# EAGLE design SparkFun_Pocket_Amp (EAGLE 7.7.0)
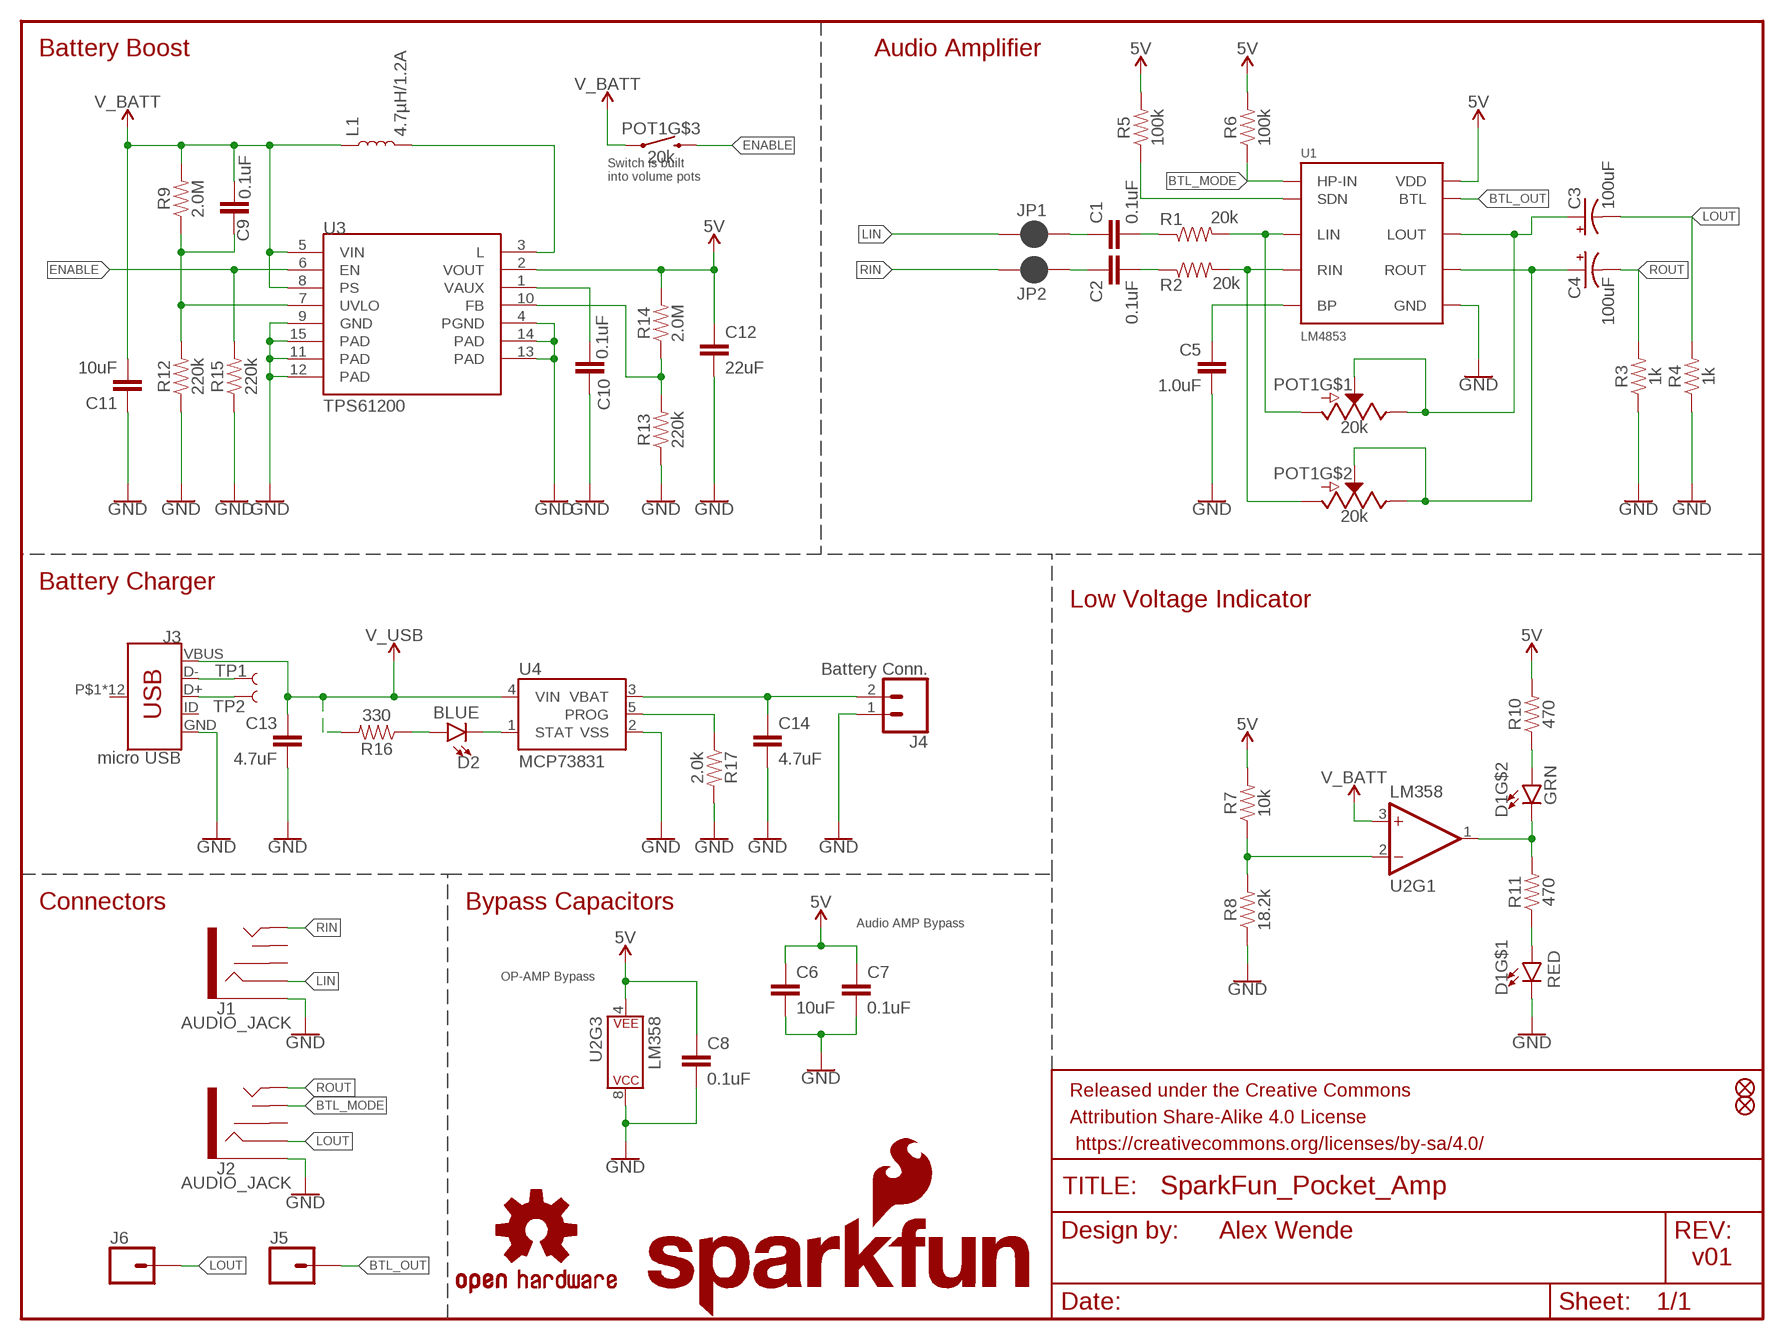
[diagram p0: schematic, sheet 1]

## Parts
C1  0.1uF  0.1UF-KIT-EZ-50V-20%  [CAP-PTH-SMALL-KIT]
C2  0.1uF  0.1UF-KIT-EZ-50V-20%  [CAP-PTH-SMALL-KIT]
C3  100uF  100UF-POLAR-RADIAL-2.5MM-25V-20%  [CPOL-RADIAL-2.5MM-6.5MM]
C4  100uF  100UF-POLAR-RADIAL-2.5MM-25V-20%  [CPOL-RADIAL-2.5MM-6.5MM]
C5  1.0uF  1.0UF-0603-16V-10%  [0603]
C6  10uF  10UF-0805-10V-10%  [0805]
C7  0.1uF  0.1UF-0603-25V-(+80/-20%)  [0603]
C8  0.1uF  0.1UF-0603-25V-(+80/-20%)  [0603]
C9  0.1uF  0.1UF-0603-25V-(+80/-20%)  [0603]
C10  0.1uF  0.1UF-0603-25V-(+80/-20%)  [0603]
C11  10uF  10UF-0805-10V-10%  [0805]
C12  22uF  22UF-1210-16V-20%  [1210]
C13  4.7uF  4.7UF0603  [0603]
C14  4.7uF  4.7UF0603  [0603]
D1  LED Inicator  LED_RG6300T15  [LED_3MM_RG_SMD]
D2  BLUE  LED-BLUE0603  [LED-0603]
FD1  FIDUCIALUFIDUCIAL  [FIDUCIAL-MICRO]
FD2  FIDUCIALUFIDUCIAL  [FIDUCIAL-MICRO]
FRAME1  FRAME-LETTER  [CREATIVE_COMMONS]
J1  AUDIO_JACK  AUDIO_JACK_3.5MM_SMD  [AUDIO-JACK-3.5MM-SMD]
J2  AUDIO_JACK  AUDIO_JACK_3.5MM_SMD  [AUDIO-JACK-3.5MM-SMD]
J3  micro USB  USB_MICRO-B_HALF_PTH  [USB-MICROB-PTH]
J4  Battery Conn.  CONN_02-JST-2MM-SMT  [JST-2-SMD]
J5  CONN_01PTH_NO_SILK_KIT  [1X01NS_KIT]
J6  CONN_01PTH_NO_SILK_KIT  [1X01NS_KIT]
JP1  JUMPER-SMT_2_NC_PASTE_NO-SILK  [SMT-JUMPER_2_NC_PASTE_NO-SILK]
JP2  JUMPER-SMT_2_NC_PASTE_NO-SILK  [SMT-JUMPER_2_NC_PASTE_NO-SILK]
L1  4.7µH/1.2A  INDUCTOR-CDRH-4.7UH  [INDUCTOR_4.7UH]
LOGO1  SFE_LOGO_NAME_FLAME.1_INCH  [SFE_LOGO_NAME_FLAME_.1]
LOGO2  OSHW-LOGOM  [OSHW-LOGO-M]
POT1  20k  POTENTIOMETER_DUAL_W/SWITCH  [POT-DUAL-SWITCH-PTH]
R1  20k  RESISTORAXIAL-0.3-KIT  [AXIAL-0.3-KIT]
R2  20k  RESISTORAXIAL-0.3-KIT  [AXIAL-0.3-KIT]
R3  1k  RESISTORAXIAL-0.3-KIT  [AXIAL-0.3-KIT]
R4  1k  RESISTORAXIAL-0.3-KIT  [AXIAL-0.3-KIT]
R5  100k  RESISTORAXIAL-0.3-KIT  [AXIAL-0.3-KIT]
R6  100k  RESISTORAXIAL-0.3-KIT  [AXIAL-0.3-KIT]
R7  10k  RESISTORAXIAL-0.3-KIT  [AXIAL-0.3-KIT]
R8  18.2k  RESISTORAXIAL-0.3-KIT  [AXIAL-0.3-KIT]
R9  2.0M  2MOHMS-0603-1/10W-1%  [0603]
R10  470  RESISTORAXIAL-0.3-KIT  [AXIAL-0.3-KIT]
R11  470  RESISTORAXIAL-0.3-KIT  [AXIAL-0.3-KIT]
R12  220k  220KOHM-0603-1/10W-1%  [0603]
R13  220k  220KOHM-0603-1/10W-1%  [0603]
R14  2.0M  2MOHMS-0603-1/10W-1%  [0603]
R15  220k  220KOHM-0603-1/10W-1%  [0603]
R16  330  330OHM-0603-1/10W-1%  [0603]
R17  2.0k  2.0KOHM-0603-1/10W-5%  [0603]
TP1  TEST-POINT3  [PAD.03X.03]
TP2  TEST-POINT3  [PAD.03X.03]
U1  LM4853  [TFSOP-10]
U2  LM358  LM358KIT  [DIP08-KIT]
U3  TPS61200  [QFN-10_PAD]
U4  MCP73831  [SOT23-5]

## Nets
5V: C6.1 C7.1 C8.1 C12.1 R5.P$2 R6.P$2 R7.P$2 R10.P$2 R14.2 U1.VDD U2.4(P$V-) U3.2(VOUT)
BTL_MODE: J2.TSH R6.P$1 U1.HP-IN
BTL_OUT: J5.1 U1.BTL
ENABLE: POT1.SW2 R15.2 U3.6(EN)
GND: C5.2 C6.2 C7.2 C8.2 C10.1 C11.1 C12.2 C13.2 C14.2 D1.1(C) J1.SLEEVE J2.SLEEVE J3.GND J4.1 R3.P$1 R4.P$1 R8.P$1 R12.1 R13.1 R15.1 R17.2 U1.GND U2.8(P$V+) U3.4(PGND) U3.9(GND) U3.11(PAD) U3.12(PAD) U3.13(PAD) U3.14(PAD) U3.15(PAD) U4.2(VSS)
IN_L: C1.1 JP1.2
IN_R: C2.1 JP2.2
LIN: J1.RING JP1.1
LOUT: C3.2(-) J2.RING J6.1 R4.P$2
N$1: POT1.A1(A) R1.P$2 U1.LIN
N$2: POT1.B1(A) R2.P$2 U1.RIN
N$3: C1.2 R1.P$1
N$4: C2.2 R2.P$1
N$5: C5.1 U1.BP
N$6: R7.P$1 R8.P$2 U2.2(-IN)
N$7: C9.1 R9.1 R12.2 U3.7(UVLO)
N$8: C3.1(+) POT1.A2(E) POT1.A3(S) U1.LOUT
N$9: R5.P$1 U1.SDN
N$10: J3.D- TP1.P$1
N$11: D1.3(A) R10.P$1
N$12: C4.1(+) POT1.B2(E) POT1.B3(S) U1.ROUT
N$13: D1.2(A) R11.P$1
N$14: D2.C U4.1(STAT)
N$15: D2.A R16.1
N$16: L1.P$2 U3.3(L)
N$17: D1.4(C) R11.P$2 U2.1(OUT)
N$18: J3.D+ TP2.P$1
N$19: C10.2 U3.1(VAUX)
N$20: R13.2 R14.1 U3.10(FB)
N$22: C14.1 J4.2 U4.3(VBAT)
N$23: R17.1 U4.5(PROG)
RIN: J1.TIP JP2.1
ROUT: C4.2(-) J2.TIP R3.P$2
V_BATT: C9.2 C11.2 L1.P$1 POT1.SW1 R9.2 U2.3(+IN) U3.5(VIN) U3.8(PS)
V_USB: C13.1 J3.VBUS R16.2 U4.4(VIN)
Unconnected: J1.RSH J1.TSH J2.RSH J3.ID J3.P$1(SHIELD) J3.P$2(SHIELD) J3.P$3(SHIELD) J3.P$4(SHIELD) J3.P$6(SHIELD) J3.P$8(SHIELD) J3.P$10(SHIELD) J3.P$12(SHIELD) J3.SHEILD2(SHIELD) J3.SHIELD J3.SHIELD3(SHIELD) J3.SHIELD4(SHIELD) U2.5(+IN) U2.6(-IN) U2.7(OUT)

## Notes on the sheet
- Battery Boost | Audio Amplifier
- Switch is built 
  into volume pots
- Battery Charger
- Low Voltage Indicator
- GRN
- Connectors | Bypass Capacitors
- Audio AMP Bypass
- OP-AMP Bypass
- RED
- Alex Wende
- v01

## Library data of the parts
C1 C2 = SparkFun-Capacitors:0.1UF: 0.1µF ceramic capacitors A capacitor is a passive two-terminal electrical component used to store electrical energy temporarily in an electric field.; PROD_ID: CAP-08370
C3 C4 = SparkFun-Capacitors:100UF-POLAR: 100µF polarized capacitors A capacitor is a passive two-terminal electrical component used to store electrical energy temporarily in an electric field.; PROD_ID: CAP-08439
C5 = SparkFun-Capacitors:1.0UF: 1µF ceramic capacitors A capacitor is a passive two-terminal electrical component used to store electrical energy temporarily in an electric field.; PROD_ID: CAP-00868
C6 C11 = SparkFun-Capacitors:10UF: 10.0µF ceramic capacitors A capacitor is a passive two-terminal electrical component used to store electrical energy temporarily in an electric field.; PROD_ID: CAP-11330
C7-C10 = SparkFun-Capacitors:0.1UF: 0.1µF ceramic capacitors A capacitor is a passive two-terminal electrical component used to store electrical energy temporarily in an electric field.; PROD_ID: CAP-00810
C12 = SparkFun-Capacitors:22UF: 22µF ceramic capacitors A capacitor is a passive two-terminal electrical component used to store electrical energy temporarily in an electric field.; PROD_ID: CAP-10381
C13 C14 = SparkFun-Capacitors:4.7UF: 4.7µF ceramic capacitors A capacitor is a passive two-terminal electrical component used to store electrical energy temporarily in an electric field.; PROD_ID: CAP-08280
D1 = SparkFun-LED:LED_RG
D2 = SparkFun-LED:LED-BLUE: Blue SMD LED Used in manufacturing of various products at SparkFun Packages: 0603 - SMD 0603 package [Product Link] <http://www.digikey.com/product-detail/en/SMLE12BC7TT86/511-1589-2-ND/1641808> 1206 - SMD1206 package [Product Link] <http://www.digikey.com/product-detail/en/lite-on-inc/LTST-C150TBKT/160-1643-1-ND/573584> SparkFun Products: ESP8266 Thing-Dev Board <https://www.sparkfun.com/products/13711> RedBoard <https://www.sparkfun.com/products/12757>; PROD_ID: DIO-08575
FD1 FD2 = SparkFun-Aesthetics:FIDUCIAL: Fiducial Alignment Points Point-of-reference for pick-and-place machines and other optical instruments.
FRAME1 = SparkFun-Aesthetics:FRAME-LETTER: Schematic Frame - Letter Standard 8.5x11 US Letter frame
J1 J2 = SparkFun-Connectors:AUDIO_JACK_3.5MM: Audio Jack 3.5mm variants of PTH and SMT stereo audio jack with bypass switches. SparkFun Products: SparkFun SparkPunk Sound Kit <[https://www.sparkfun.com/products/11177]> - PTH MP3 Trigger <https://www.sparkfun.com/products/13720> -3.5mm SMD SparkFun PicoBoard <https://www.sparkfun.com/products/11888>- 2.5mm SMD; PROD_ID: CONN-10353
J3 = SparkFun-Connectors:USB_MICRO-B: USB Type Micro-B Connector Male/female and PTH/SMT variants SparkFun Products: SparkFun microB USB Breakout <https://www.sparkfun.com/products/12035> SparkFun USB microB Plug Breakout <https://www.sparkfun.com/products/10031> SparkFun ESP8266 Thing <https://www.sparkfun.com/products/13231>; PROD_ID: CONN-13711; VALUE: AMP FCI 10103594-0001LF
J4 = SparkFun-Connectors:CONN_02: Multi connection point. Often used as Generic Header-pin footprint for 0.1 inch spaced/style header connections On any of the 0.1 inch spaced packages, you can populate with these: Break Away Headers - Straight (PRT-00116) Break Away Male Headers - Right Angle (PRT-00553) Female Headers (PRT-00115) Break Away Headers - Machine Pin (PRT-00117) Break Away Female Headers - Swiss Machine Pin (PRT-00743) For SCREWTERMINALS and SPRING TERMINALS visit here: Screw Terimnals on SparkFun.com (5mm/3.5mm/2.54mm spacing) This device is also useful as a general connection point to wire up your design to another part of your project. Our various solder wires solder well into these plated through hole pads. Hook-Up Wire - Assortment (Stranded, 22 AWG) (PRT-11375) Hook-Up Wire - Assortment (Solid Core, 22 AWG) (PRT-11367) View the entire wire category on our website here Special notes: Molex polarized connector foot print use with: PRT-08233 with associated crimp pins and housings. 2.54_SCREWTERM for use with PRT-10571. 3.5mm Screw Terminal footprints for PRT-08084 5mm Screw Terminal footprints for use with PRT-08432; PROD_ID: CONN-11443
J5 J6 = SparkFun-Connectors:CONN_01: Single connection point. Often used as Generic Header-pin footprint for 0.1 inch spaced/style header connections On any of the 0.1 inch spaced packages, you can populate with these: Break Away Headers - Straight (PRT-00116) Break Away Male Headers - Right Angle (PRT-00553) Female Headers (PRT-00115) Break Away Headers - Machine Pin (PRT-00117) Break Away Female Headers - Swiss Machine Pin (PRT-00743) This device is also useful as a general connection point to wire up your design to another part of your project. Our various solder wires solder well into these plated through hole pads. Hook-Up Wire - Assortment (Stranded, 22 AWG) (PRT-11375) Hook-Up Wire - Assortment (Solid Core, 22 AWG) (PRT-11367) View the entire wire category on our website here Special notes: SMTSO-256-ET is a "flush mount" nut for a 4-40 screw. We mostly use this on specialty testbeds; it is a nice way to connect hardware to your PCB at an adjustable hieght. Also note, the SNAP packages are for using a snappable style connector. We sell a baggie of snaps and they are also used on two LilyPad designs: Snap Assortment - 30 pack (male and female) (DEV-11347) LilyPad Arduino SimpleSnap (DEV-10941) LilyPad SimpleSnap Protoboard (DEV-10940)
JP1 JP2 = SparkFun-Jumpers:JUMPER-SMT_2_NC_PASTE: Normally closed solder jumper This jumper has an aperture in the stencil to allow solder paste to bridge the split in the wire so it's normally closed (NC). Wick off the solder to open the connection. Reapply solder to reclose the connection.
L1 = SparkFun-Coils:INDUCTOR: Inductors Resist changes in electrical current. Basically a coil of wire. SparkFun Products: SparkFun Load Cell Amplifier - HX711 IOIO-OTG - V2.2; PROD_ID: NDUC-10146; VALUE: 4.7µH/±30%/1.2A
LOGO1 = SparkFun-Aesthetics:SFE_LOGO_NAME_FLAME: SparkFun Font Logo w/ Flame This is the SparkFun full logo. The logo on the schematic will always be the same size; the package variant is the height of the flame part of the logo. Default layer for the logo on the board is tSilk.
LOGO2 = SparkFun-Aesthetics:OSHW-LOGO: Open-Source Hardware (OSHW) Logo This logo indicates the piece of hardware it is found on incorporates a OSHW license and/or adheres to the definition of open source hardware found here: http://freedomdefined.org/OSHW
POT1 = SparkFun-Resistors:POTENTIOMETER_DUAL_W/SWITCH
R1-R8 R10 R11 = SparkFun-Resistors:RESISTOR: Generic Resistor Package
R9 R14 = SparkFun-Resistors:2MOHMS: 2MΩ resistor A resistor is a passive two-terminal electrical component that implements electrical resistance as a circuit element. Resistors act to reduce current flow, and, at the same time, act to lower voltage levels within circuits. - Wikipedia; PROD_ID: RES-10054
R12 R13 R15 = SparkFun-Resistors:220KOHM: 220kΩ resistor A resistor is a passive two-terminal electrical component that implements electrical resistance as a circuit element. Resistors act to reduce current flow, and, at the same time, act to lower voltage levels within circuits. - Wikipedia; PROD_ID: RES-08969
R16 = SparkFun-Resistors:330OHM: 330Ω resistor A resistor is a passive two-terminal electrical component that implements electrical resistance as a circuit element. Resistors act to reduce current flow, and, at the same time, act to lower voltage levels within circuits. - Wikipedia; PROD_ID: RES-00818
R17 = SparkFun-Resistors:2.0KOHM: 2kΩ resistor A resistor is a passive two-terminal electrical component that implements electrical resistance as a circuit element. Resistors act to reduce current flow, and, at the same time, act to lower voltage levels within circuits. - Wikipedia; PROD_ID: RES-08296
TP1 TP2 = SparkFun-Connectors:TEST-POINT: SparkFun Test Points Bare copper test points for troubleshooting or In-Circuit-Testing. These are used by our Production team for verifying production board runs using pogo-pins on test beds. SparkFun Products: SparkFun LSM9DS1 Breakout <https://www.sparkfun.com/products/13284> SparkFun PSOC <https://www.sparkfun.com/products/13714> SparkFun Load Cell Amplifier <https://www.sparkfun.com/products/13879>
U1 = SparkFun-IC-Amplifiers:LM4853
U2 = SparkFun-IC-Amplifiers:LM358: LM358 Jellybean op-amp Datasheet SparkFun Products Op-Amp (Thru-Hole) - LM358 (COM-09456); PROD_ID: IC-09172
U3 = SparkFun-IC-Power:TPS61200: DC to DC Booster IC-10035; PROD_ID: IC-10035
U4 = SparkFun-IC-Power:MCP73831: MCP73831T Li-Ion, Li-Pol Controller Miniature single cell, fully integrated Li-Ion, Li-polymer charge management controller Datasheet <http://ww1.microchip.com/downloads/en/DeviceDoc/20001984g.pdf> SparkFun Products: SparkFun ESP32 Thing <https://www.sparkfun.com/products/13907> SparkFun 9DoF Razor IMU M0 <https://www.sparkfun.com/products/14001>; PROD_ID: IC-09995

## Board
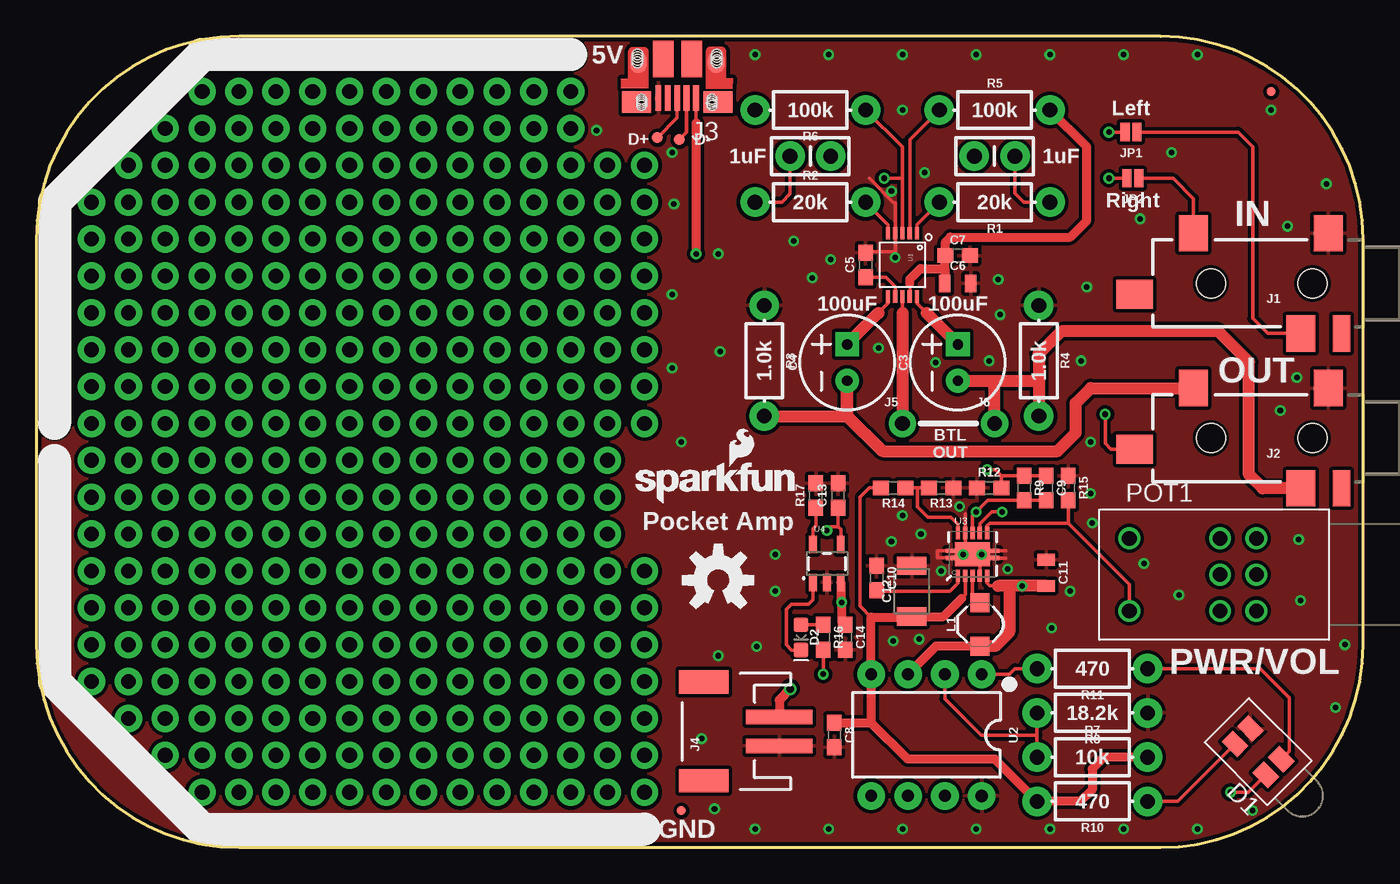
[diagram p1: board, top side]
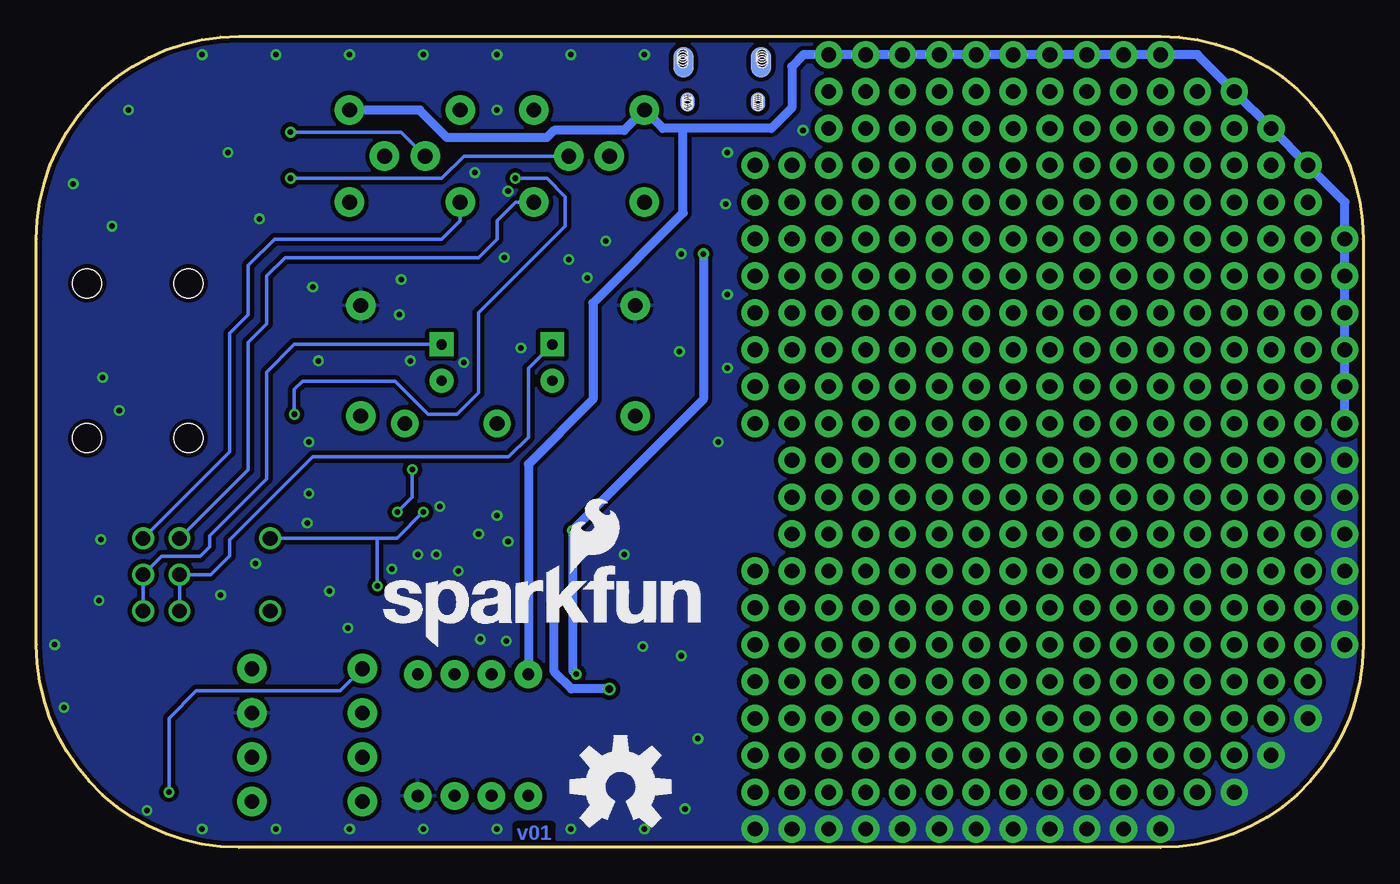
[diagram p2: board, bottom side, seen from below]

Size 91.44 x 55.88 mm. Coordinates in mm from the lower left corner, seen from the top.
Outline: 91.44,13.97 91.44,41.91 arc90 77.47,55.88 13.97,55.88 arc90 0,41.91 0,13.97 arc90 13.97,0 77.47,0 arc90 91.44,13.97
Copper layers (1*16): Top 0.035mm / dielectric 1.5mm / Bottom 0.035mm
Design rules "SparkFun-2-layer-TIGHT": minimum track width 7mil, minimum drill 15mil, track to track 7mil, track to pad 7mil, pad to pad 7mil, via to via 7mil, smd to smd 7mil, copper to edge 7mil, drill to drill 7mil, minimum pad ring 7mil, minimum via ring 7mil, stop-mask expansion 4mil, vias tented up to drill 25mil, thermal gap 10mil

### Footprints (pad centres in the part's own frame; a part is rotated, then mirrored left to right if it is on the bottom)
CAP-PTH-SMALL-KIT = drill 1.016 pad 2.032: 1 -1.397,0; 2 1.397,0
CPOL-RADIAL-2.5MM-6.5MM = drill 0.7 pad 1.651 square: 1 1.25,0 | drill 0.7 pad 1.651: 2 -1.25,0
0603 = smd 1.1 x 1: 1 -0.85,0; 2 0.85,0
0805 = smd 0.8 x 1.2: 1 -0.9,0; 2 0.9,0
1210 = smd 1.27 x 2.06: 1 -1.755,0; 2 1.755,0
LED_3MM_RG_SMD = smd 1.5 x 1.1: 1 1.5,-0.75; 2 -1.5,-0.75; 3 1.5,0.75; 4 -1.5,0.75
LED-0603 = smd 1 x 1: A -0.877,0; C 0.877,0
FIDUCIAL-MICRO = smd 0.635 x 0.635: 1 0,0
AUDIO-JACK-3.5MM-SMD = smd 2 x 2.5: RING 4.3,3.45; SLEEVE 2.4,-3.45; TIP 11.7,-3.45 | smd 1.2 x 2.5: RSH 1.5,3.45 | smd 2.5 x 2: TSH 15.75,0.75 | hole 2: 3.5,0; 10.5,0
USB-MICROB-PTH = smd 0.4 x 1.75: D+ 0.031,1.331; D- -0.619,1.331; GND 1.331,1.331; ID 0.681,1.331; VBUS -1.269,1.331 | smd 1.4 x 2.1 bottom: P$1 2.701,-1.142; P$3 -2.659,-1.144 | smd 1 x 1.3: P$2 2.487,1.594; P$6 -2.368,1.604 | smd 1 x 1.3 bottom: P$4 -2.368,1.604; P$10 2.481,1.598 | smd 1.1 x 1.5: P$8 2.701,-1.142; P$12 -2.659,-1.144 | smd 2 x 1.46: SHEILD2 2.831,1.606; SHIELD -2.794,1.606 | smd 1.425 x 2.5: SHIELD3 -0.979,-1.349; SHIELD4 0.996,-1.352 | hole 0.7: -2.693,-1.134; -2.693,-1.3; -2.694,-1.499; -2.694,-1.664; 2.768,-1.134; 2.767,-1.303; 2.766,-1.496; 2.766,-1.664 | hole 0.66: -2.359,1.821; -2.349,1.691; -2.359,1.541; -2.354,1.432; 2.481,1.821; 2.491,1.691; 2.481,1.541; 2.486,1.432
JST-2-SMD = smd 1 x 4.6: 1 -1,-3.7; 2 1,-3.7 | smd 1.6 x 3.4: NC1 -3.4,1.5; NC2 3.4,1.5
1X01NS_KIT = drill 1.016 pad 1.88: 1 0,0
SMT-JUMPER_2_NC_PASTE_NO-SILK = smd 0.635 x 1.27: 1 -0.406,0; 2 0.406,0
INDUCTOR_4.7UH = smd 1.3 x 1.3: P$1 -1.5,0; P$2 1.5,0
POT-DUAL-SWITCH-PTH = drill 1: A1 0,2.5; A2 0,0; A3 0,-2.5; B1 -2.5,2.5; B2 -2.5,0; B3 -2.5,-2.5; SW1 -8.75,2.5; SW2 -8.75,-2.5
AXIAL-0.3-KIT = drill 1.016 pad 2.032: P$1 -3.81,0; P$2 3.81,0
PAD.03X.03 = smd 0.762 x 0.762: P$1 0,0
TFSOP-10 = smd 0.85 x 0.29: BP 2.175,-0.5; BTL 2.175,0; GND -2.175,-0.5; HP-IN -2.175,0; LIN -2.175,1; LOUT 2.175,1; RIN -2.175,-1; ROUT 2.175,-1; SDN -2.175,0.5; VDD 2.175,0.5
DIP08-KIT = drill 0.813 pad 1.905: 1 -3.81,-4.191; 2 -1.27,-4.191; 3 1.27,-4.191; 4 3.81,-4.191; 5 3.81,4.191; 6 1.27,4.191; 7 -1.27,4.191 | drill 0.864 pad 1.905: 8 -3.81,4.191
QFN-10_PAD = smd 0.297 x 0.85: 1 -1,-1.475; 2 -0.5,-1.475; 3 0,-1.475; 4 0.5,-1.475; 5 1,-1.475; 6 1,1.475; 7 0.5,1.475; 8 0,1.475; 9 -0.5,1.475; 10 -1,1.475 | smd 0.7 x 0.28: 11 -1.5,0.25; 12 -1.5,-0.25; 13 1.5,0.25; 14 1.5,-0.25 | smd 2.4 x 1.65: 15 0,0
SOT23-5 = smd 0.55 x 1.2: 1 -0.95,-1.3; 2 0,-1.3; 3 0.95,-1.3; 4 0.95,1.3; 5 -0.95,1.3

### Placement (x,y rotation side)
C1  66.04,47.62 0 top
C2  53.34,47.62 180 top
C3  63.5,33.4 90 top
C4  55.88,33.4 90 top
C5  57.15,40.13 90 top
C6  63.5,38.86 0 top
C7  63.5,40.77 0 top
C8  54.99,7.75 270 top
C9  69.6,24.77 270 top
C10  57.91,18.57 270 top
C11  69.6,18.92 270 top
C12  60.33,17.65 90 top
C13  55.24,24.26 90 top
C14  55.75,14.48 270 top
D1  84.2,6.6 135 top
D2  52.7,14.48 270 top
FD1  44.45,2.54 0 top
FD2  85.09,52.07 0 top
FRAME1  12.7,-21.59 0 top  (outside the outline)
J1  91.44,38.86 180 top
J2  91.44,28.19 180 top
J3  44.2,52.96 180 top
J4  47.5,8 90 top
J5  59.69,29.21 0 top
J6  66.04,29.21 0 top
JP1  75.44,49.28 180 top
JP2  75.56,46.1 180 top
L1  65.02,15.37 90 top
LOGO1  40.89,23.62 0 top
LOGO2  46.99,18.41 0 top
POT1  84.07,18.8 0 top
R1  66.04,44.45 180 top
R2  53.34,44.45 0 top
R3  50.16,33.53 270 top
R4  69.09,33.53 270 top
R5  66.04,50.8 0 top
R6  53.34,50.8 180 top
R7  72.77,6.22 0 top
R8  72.77,9.27 180 top
R9  68.07,24.77 270 top
R10  72.77,3.17 180 top
R11  72.77,12.32 180 top
R12  65.66,24.77 0 top
R13  62.36,24.77 180 top
R14  59.05,24.77 180 top
R15  71.12,24.77 270 top
R16  54.23,14.48 270 top
R17  53.72,24.26 90 top
TP1  44.32,48.77 0 top
TP2  42.8,48.9 0 top
U1  59.69,40.13 270 top
U2  61.34,7.75 180 top
U3  64.52,20.19 0 top
U4  54.48,19.56 0 top
U$1  [SFE_LOGO_NAME_FLAME_.2]  68.2,13.72 0 bottom
U$2  [OSHW-LOGO-L]  51.18,4.19 0 bottom

### Tracks (layer width: path | path; a pad name or v marks a point on that pad's centre or on a via)
5V  (via drill 1.02 pad 1.88)
  Top 0.254: U1.VDD 60.19,38.85 | U3.2 64.02,17.41 63.75,17.14 | R14.2 57.4,24.77 56.77,24.13 56.77,16.64 57.53,15.88
  Top 0.61: 60.19,38.85 60.19,39.13 60.94,39.88 62.6,39.88 | 62.6,39.88 C6.1 | 62.6,39.88 62.6,40.72 C7.1 62.65,41.7 62.99,42.04 71.25,42.04 72.39,43.18 72.39,48.26 R5.P$2 | 57.53,8.6 U2.4 57.53,15.88 60.2,15.88 C12.1 62.51,15.9 63.75,17.14 | 57.53,8.6 60.03,6.1 66.04,6.1 R10.P$2 71.96,3.17 72.77,3.99 72.77,5.41 73.58,6.22 R7.P$2 | C8.1 57.53,8.6
  Bottom 0.61: R5.P$2 65.02,50.8 63.12,48.9 56.26,48.9 55.75,49.4 50.93,49.4 R6.P$2 48.26,49.53 46.86,49.53 | U2.4 57.53,26.42 53.09,30.86 53.09,37.49 46.86,43.72 46.86,49.53 | 46.86,49.53 40.79,49.53 39.37,50.95 39.37,53.8 38.56,54.61 v36.83,54.61 v34.29,54.61 v31.75,54.61 v29.21,54.61 v26.67,54.61 v24.13,54.61 v21.59,54.61 v19.05,54.61 v16.51,54.61 v13.97,54.61 11.43,54.61 v8.89,52.07 v6.35,49.53 v3.81,46.99 1.27,44.45 v1.27,41.91 v1.27,39.37 v1.27,36.83 v1.27,34.29 v1.27,31.75 v1.27,29.21
BTL_MODE  (via drill 0.38)
  Top 0.254: R6.P$1 59.69,48.26 59.69,46.1 | 59.69,46.1 U1.HP-IN | J2.TSH 74.05,27.44 73.66,27.83 v73.66,29.84 | v58.42,46.1 59.69,46.1
  Bottom 0.254: v73.66,29.84 73.66,31.56 73.09,32.13 66.72,32.13 64.44,29.84 62.44,29.84 60.96,31.33 60.96,36.83 54.99,42.8 54.99,44.84 56.25,46.1 v58.42,46.1
BTL_OUT
  Top 0.254: U1.BTL 59.69,36.83
  Top 0.813: 59.69,36.83 J5.1
ENABLE
  Top 0.254: R15.2 71.12,22.35 | 71.12,22.35 65.71,22.35 65.52,22.16 U3.6 | 71.12,22.35 75.32,18.15 POT1.SW2
GND  (via drill 0.38, 1.02 pad 1.88)
  Top 0.254: 57.15,41.02 59.19,41.02 U1.GND 59.19,44.42 59.08,44.42 57.4,46.1 | U3.15 64.02,20.19 U3.9 64.02,23 | U3.4 65.02,20.19 U3.15 | U3.14 66.8,19.94 | 64.52,20.45 66.8,20.45 | U3.15 64.52,20.45 | 64.52,20.45 62.1,20.45 62.1,19.94 U3.12
  other vias: 88.9,45.72 86.23,42.8 86.87,32.38 85.72,30.1 59.05,14.22 60.83,14.35 65.15,20.19 63.88,20.19 58.93,21.08 60.96,21.59 59.69,22.86 62.36,19.05 66.93,19.18 71.25,17.65 63.63,23.5 41.91,1.27 39.37,1.27 36.83,1.27 34.29,1.27 31.75,1.27 29.21,1.27 26.67,1.27 24.13,1.27 21.59,1.27 19.05,1.27 16.51,1.27 13.97,1.27 8.89,3.81 6.35,6.35 3.81,8.89 1.27,13.97 1.27,16.51 1.27,19.05 1.27,21.59 1.27,24.13 1.27,26.67 49.53,54.61 54.61,54.61 59.69,54.61 64.77,54.61 69.85,54.61 74.93,54.61 80.01,54.61 85.09,50.8 90.17,13.97 89.53,9.65 83.82,2.54 80.01,1.27 74.93,1.27 69.85,1.27 64.77,1.27 59.69,1.27 54.61,1.27 49.53,1.27 69.98,15.11 50.93,20.19 50.93,17.65 49.66,13.84 46.99,13.21 45.85,7.49 46.74,2.67 54.74,40.51 52.2,41.78 53.47,39.24 58.04,34.42 65.66,33.53 61.98,33.4 66.29,39.12 66.42,36.7 72.39,38.61 72.01,33.53 72.64,27.94 72.64,24.38 72.77,22.35 76.33,19.56 78.74,17.4 87,21.21 87.12,17.02 46.99,40.89 47.12,34.16 44.45,27.94 38.61,49.4 43.81,47.88 43.94,44.32 43.81,38.1 43.81,33.02 59.18,40.64 58.93,45.21 59.69,50.8 61.21,46.48 76.07,43.31 78.23,47.88
  pour Top (isolate 0.254, rank 2): 0,41.91 0,13.97 arc90 13.97,0 77.47,0 arc90 91.44,13.97 91.44,41.91 arc90 77.47,55.88 13.97,55.88 arc90
  pour Bottom (isolate 0.305, rank 2): 0,41.91 0,13.97 arc90 13.97,0 77.47,0 arc90 91.44,13.97 91.44,41.91 arc90 77.47,55.88 13.97,55.88 arc90
IN_L  (via drill 0.38)
  Top 0.254: JP1.2 v73.91,49.28
  Bottom 0.254: C1.1 66.29,49.28 v73.91,49.28
IN_R  (via drill 0.38)
  Top 0.254: JP2.2 v73.91,46.1
  Bottom 0.254: v73.91,46.1 63.5,46.1 61.98,47.62 C2.1
LIN
  Top 0.254: J1.RING 84.85,35.41 83.82,36.45 83.82,48.28 82.83,49.28 JP1.1
LOUT
  Top 0.813: 69.09,32.15 69.09,34.02 70.63,35.56 81.45,35.56 83.57,33.45 83.57,25.69 84.51,24.74 J2.RING | 69.09,32.15 R4.P$2 | C3.2 66.04,32.15 | 66.04,32.15 69.09,32.15 | J6.1 66.04,32.15
N$1
  Top 0.254: R1.P$2 60.69,42.91 U1.LIN
  Bottom 0.254: R1.P$2 62.23,43.18 63.5,41.91 75.03,41.91 76.83,40.1 76.83,36.7 78.11,35.43 78.11,27.27 POT1.A1
N$2
  Top 0.254: R2.P$2 58.69,42.91 U1.RIN
  Bottom 0.254: R2.P$2 58.42,44.45 59.69,43.18 59.69,41.91 60.96,40.64 74.3,40.64 75.56,39.37 75.56,36.07 76.83,34.8 76.83,26.04 POT1.B1
N$3
  Top 0.254: C1.2 67.44,45.09 68.07,44.45 R1.P$1
N$4
  Top 0.254: C2.2 51.94,45.02 51.38,44.45 R2.P$1
N$5
  Top 0.254: C5.1 58.55,39.28 59.19,38.64 U1.BP
N$6
  Top 0.254: U2.2 62.61,10.26 65.12,7.75 68.96,7.75 | 68.96,7.75 R8.P$2 | R7.P$1 68.96,7.75
N$7  (via drill 0.38)
  Top 0.254: 68.07,25.65 R9.1 | R9.1 C9.1 | U3.7 65.02,22.3 65.83,23.11 v66.55,23.11 | 66.55,24.77 R12.2 66.51,25.61 | R9.1 66.51,25.61 | v65.53,26.04 66.09,26.04 66.51,25.61
  Bottom 0.254: v66.55,23.11 65.53,24.13 v65.53,26.04
N$8
  Top 0.254: U1.LOUT 60.69,37.48 61.34,36.83
  Top 0.813: 61.34,36.83 63.5,34.67 C3.1
  Bottom 0.254: POT1.A3 POT1.A2 82.8,20.07 80.14,20.07 79.5,20.7 79.5,21.46 75.56,25.4 75.56,32.75 73.66,34.65 C3.1
N$9
  Top 0.254: R5.P$1 60.19,48.76 U1.SDN
N$10
  Top 0.254: J3.D- 44.81,49.26 TP1.P$1
N$11
  Top 0.254: D1.3 78.65,3.17 R10.P$1
N$12
  Top 0.254: U1.ROUT 58.69,37.48 58.04,36.83
  Top 0.813: 58.04,36.83 55.88,34.67 C4.1
  Bottom 0.254: POT1.B3 POT1.B2 79.41,18.8 78.11,20.1 78.11,21.21 72.39,26.92 58.88,26.92 57.53,28.27 57.53,33.02 55.88,34.67 C4.1
N$13
  Top 0.254: R11.P$1 84.35,12.32 86.36,10.31 86.36,6.64 D1.2
N$14
  Top 0.254: U4.1 53.53,17.08 53.21,16.76 52.05,16.76 51.69,16.41 51.69,13.95 52.04,13.6 D2.C
N$15
  Top 0.254: D2.A 54.23,15.36 R16.1
N$16
  Top 0.254: U3.3 64.52,16.99 65.02,16.99 L1.P$2
N$17  (via drill 0.38)
  Top 0.254: U2.1 67.06,11.94 67.44,12.32 R11.P$2 | v82.3,3.81 83.53,3.81 D1.4
  Bottom 0.254: v82.3,3.81 82.3,8.91 80.41,10.79 70.48,10.79 R11.P$2
N$18
  Top 0.254: J3.D+ 44.16,50.26 TP2.P$1
N$19
  Top 0.254: U3.1 63.52,18.2 62.97,17.65 57.91,17.65 C10.2
N$20
  Top 0.254: U3.10 63.52,22.26 63.05,22.73 61.45,22.73 60.71,23.47 60.71,24.77 | 60.71,24.77 R13.2 | R14.1 60.71,24.77
N$22  (via drill 0.38, 0.51)
  Top 0.61: v51.94,10.92 51.2,10.18 J4.2 | U4.3 55.43,16.96 v55.5,16.89 55.5,15.58 C14.1
  Bottom 0.61: v51.94,10.92 54.55,10.92 55.75,12.12 55.75,16.64 v55.5,16.89
N$23
  Top 0.254: U4.5 53.53,21.97 53.72,22.16 R17.1
N$34  (via drill 1.02 pad 1.88)
  other vias: 3.81,41.91
N$35  (via drill 1.02 pad 1.88)
  other vias: 3.81,44.45
N$39  (via drill 1.02 pad 1.88)
  other vias: 11.43,52.07
N$41  (via drill 1.02 pad 1.88)
  other vias: 13.97,52.07
N$51  (via drill 1.02 pad 1.88)
  other vias: 36.83,52.07
N$52  (via drill 1.02 pad 1.88)
  other vias: 36.83,49.53
N$53  (via drill 1.02 pad 1.88)
  other vias: 36.83,46.99
N$54  (via drill 1.02 pad 1.88)
  other vias: 39.37,46.99
N$55  (via drill 1.02 pad 1.88)
  other vias: 41.91,46.99
N$56  (via drill 1.02 pad 1.88)
  other vias: 36.83,44.45
N$57  (via drill 1.02 pad 1.88)
  other vias: 36.83,41.91
N$58  (via drill 1.02 pad 1.88)
  other vias: 36.83,39.37
N$59  (via drill 1.02 pad 1.88)
  other vias: 36.83,36.83
N$60  (via drill 1.02 pad 1.88)
  other vias: 36.83,34.29
N$61  (via drill 1.02 pad 1.88)
  other vias: 36.83,31.75
N$62  (via drill 1.02 pad 1.88)
  other vias: 36.83,29.21
N$63  (via drill 1.02 pad 1.88)
  other vias: 36.83,26.67
N$64  (via drill 1.02 pad 1.88)
  other vias: 36.83,24.13
N$65  (via drill 1.02 pad 1.88)
  other vias: 36.83,21.59
N$66  (via drill 1.02 pad 1.88)
  other vias: 36.83,19.05
N$67  (via drill 1.02 pad 1.88)
  other vias: 36.83,16.51
N$68  (via drill 1.02 pad 1.88)
  other vias: 36.83,13.97
N$69  (via drill 1.02 pad 1.88)
  other vias: 36.83,11.43
N$70  (via drill 1.02 pad 1.88)
  other vias: 36.83,8.89
N$71  (via drill 1.02 pad 1.88)
  other vias: 36.83,6.35
N$72  (via drill 1.02 pad 1.88)
  other vias: 36.83,3.81
N$83  (via drill 1.02 pad 1.88)
  other vias: 11.43,3.81
N$88  (via drill 1.02 pad 1.88)
  other vias: 13.97,3.81
N$89  (via drill 1.02 pad 1.88)
  other vias: 16.51,3.81
N$90  (via drill 1.02 pad 1.88)
  other vias: 19.05,3.81
N$91  (via drill 1.02 pad 1.88)
  other vias: 21.59,3.81
N$92  (via drill 1.02 pad 1.88)
  other vias: 24.13,3.81
N$93  (via drill 1.02 pad 1.88)
  other vias: 26.67,3.81
N$94  (via drill 1.02 pad 1.88)
  other vias: 29.21,3.81
N$95  (via drill 1.02 pad 1.88)
  other vias: 31.75,3.81
N$96  (via drill 1.02 pad 1.88)
  other vias: 34.29,3.81
N$97  (via drill 1.02 pad 1.88)
  other vias: 34.29,6.35
N$98  (via drill 1.02 pad 1.88)
  other vias: 31.75,6.35
N$99  (via drill 1.02 pad 1.88)
  other vias: 29.21,6.35
N$100  (via drill 1.02 pad 1.88)
  other vias: 26.67,6.35
N$101  (via drill 1.02 pad 1.88)
  other vias: 24.13,6.35
N$102  (via drill 1.02 pad 1.88)
  other vias: 21.59,6.35
N$103  (via drill 1.02 pad 1.88)
  other vias: 19.05,6.35
N$104  (via drill 1.02 pad 1.88)
  other vias: 16.51,6.35
N$105  (via drill 1.02 pad 1.88)
  other vias: 13.97,6.35
N$106  (via drill 1.02 pad 1.88)
  other vias: 11.43,6.35
N$107  (via drill 1.02 pad 1.88)
  other vias: 8.89,6.35
N$108  (via drill 1.02 pad 1.88)
  other vias: 34.29,8.89
N$109  (via drill 1.02 pad 1.88)
  other vias: 31.75,8.89
N$110  (via drill 1.02 pad 1.88)
  other vias: 29.21,8.89
N$111  (via drill 1.02 pad 1.88)
  other vias: 26.67,8.89
N$112  (via drill 1.02 pad 1.88)
  other vias: 24.13,8.89
N$113  (via drill 1.02 pad 1.88)
  other vias: 21.59,8.89
N$114  (via drill 1.02 pad 1.88)
  other vias: 19.05,8.89
N$115  (via drill 1.02 pad 1.88)
  other vias: 16.51,8.89
N$116  (via drill 1.02 pad 1.88)
  other vias: 13.97,8.89
N$117  (via drill 1.02 pad 1.88)
  other vias: 11.43,8.89
N$118  (via drill 1.02 pad 1.88)
  other vias: 8.89,8.89
N$119  (via drill 1.02 pad 1.88)
  other vias: 6.35,8.89
N$120  (via drill 1.02 pad 1.88)
  other vias: 34.29,11.43
N$121  (via drill 1.02 pad 1.88)
  other vias: 31.75,11.43
N$122  (via drill 1.02 pad 1.88)
  other vias: 29.21,11.43
N$123  (via drill 1.02 pad 1.88)
  other vias: 26.67,11.43
N$124  (via drill 1.02 pad 1.88)
  other vias: 24.13,11.43
N$125  (via drill 1.02 pad 1.88)
  other vias: 21.59,11.43
N$126  (via drill 1.02 pad 1.88)
  other vias: 19.05,11.43
N$127  (via drill 1.02 pad 1.88)
  other vias: 16.51,11.43
N$128  (via drill 1.02 pad 1.88)
  other vias: 13.97,11.43
N$129  (via drill 1.02 pad 1.88)
  other vias: 11.43,11.43
N$130  (via drill 1.02 pad 1.88)
  other vias: 8.89,11.43
N$131  (via drill 1.02 pad 1.88)
  other vias: 6.35,11.43
N$132  (via drill 1.02 pad 1.88)
  other vias: 3.81,11.43
N$133  (via drill 1.02 pad 1.88)
  other vias: 3.81,13.97
N$134  (via drill 1.02 pad 1.88)
  other vias: 6.35,13.97
N$135  (via drill 1.02 pad 1.88)
  other vias: 8.89,13.97
N$136  (via drill 1.02 pad 1.88)
  other vias: 11.43,13.97
N$137  (via drill 1.02 pad 1.88)
  other vias: 13.97,13.97
N$138  (via drill 1.02 pad 1.88)
  other vias: 16.51,13.97
N$139  (via drill 1.02 pad 1.88)
  other vias: 19.05,13.97
N$140  (via drill 1.02 pad 1.88)
  other vias: 21.59,13.97
N$141  (via drill 1.02 pad 1.88)
  other vias: 24.13,13.97
N$142  (via drill 1.02 pad 1.88)
  other vias: 26.67,13.97
N$143  (via drill 1.02 pad 1.88)
  other vias: 29.21,13.97
N$144  (via drill 1.02 pad 1.88)
  other vias: 31.75,13.97
N$145  (via drill 1.02 pad 1.88)
  other vias: 34.29,13.97
N$146  (via drill 1.02 pad 1.88)
  other vias: 34.29,16.51
N$147  (via drill 1.02 pad 1.88)
  other vias: 31.75,16.51
N$148  (via drill 1.02 pad 1.88)
  other vias: 29.21,16.51
N$149  (via drill 1.02 pad 1.88)
  other vias: 26.67,16.51
N$150  (via drill 1.02 pad 1.88)
  other vias: 24.13,16.51
N$151  (via drill 1.02 pad 1.88)
  other vias: 21.59,16.51
N$152  (via drill 1.02 pad 1.88)
  other vias: 19.05,16.51
N$153  (via drill 1.02 pad 1.88)
  other vias: 16.51,16.51
N$154  (via drill 1.02 pad 1.88)
  other vias: 13.97,16.51
N$155  (via drill 1.02 pad 1.88)
  other vias: 11.43,16.51
N$156  (via drill 1.02 pad 1.88)
  other vias: 8.89,16.51
N$157  (via drill 1.02 pad 1.88)
  other vias: 6.35,16.51
N$158  (via drill 1.02 pad 1.88)
  other vias: 3.81,16.51
N$159  (via drill 1.02 pad 1.88)
  other vias: 3.81,19.05
N$160  (via drill 1.02 pad 1.88)
  other vias: 6.35,19.05
N$161  (via drill 1.02 pad 1.88)
  other vias: 8.89,19.05
N$162  (via drill 1.02 pad 1.88)
  other vias: 11.43,19.05
N$163  (via drill 1.02 pad 1.88)
  other vias: 13.97,19.05
N$164  (via drill 1.02 pad 1.88)
  other vias: 16.51,19.05
N$165  (via drill 1.02 pad 1.88)
  other vias: 19.05,19.05
N$166  (via drill 1.02 pad 1.88)
  other vias: 21.59,19.05
N$167  (via drill 1.02 pad 1.88)
  other vias: 24.13,19.05
N$168  (via drill 1.02 pad 1.88)
  other vias: 26.67,19.05
N$169  (via drill 1.02 pad 1.88)
  other vias: 29.21,19.05
N$170  (via drill 1.02 pad 1.88)
  other vias: 31.75,19.05
N$171  (via drill 1.02 pad 1.88)
  other vias: 34.29,19.05
N$172  (via drill 1.02 pad 1.88)
  other vias: 34.29,21.59
N$173  (via drill 1.02 pad 1.88)
  other vias: 31.75,21.59
N$174  (via drill 1.02 pad 1.88)
  other vias: 29.21,21.59
N$175  (via drill 1.02 pad 1.88)
  other vias: 26.67,21.59
N$176  (via drill 1.02 pad 1.88)
  other vias: 24.13,21.59
N$177  (via drill 1.02 pad 1.88)
  other vias: 21.59,21.59
N$178  (via drill 1.02 pad 1.88)
  other vias: 19.05,21.59
N$179  (via drill 1.02 pad 1.88)
  other vias: 16.51,21.59
N$180  (via drill 1.02 pad 1.88)
  other vias: 13.97,21.59
N$181  (via drill 1.02 pad 1.88)
  other vias: 11.43,21.59
N$182  (via drill 1.02 pad 1.88)
  other vias: 8.89,21.59
N$183  (via drill 1.02 pad 1.88)
  other vias: 6.35,21.59
N$184  (via drill 1.02 pad 1.88)
  other vias: 3.81,21.59
N$185  (via drill 1.02 pad 1.88)
  other vias: 34.29,24.13
N$186  (via drill 1.02 pad 1.88)
  other vias: 31.75,24.13
N$187  (via drill 1.02 pad 1.88)
  other vias: 29.21,24.13
N$188  (via drill 1.02 pad 1.88)
  other vias: 26.67,24.13
N$189  (via drill 1.02 pad 1.88)
  other vias: 24.13,24.13
N$190  (via drill 1.02 pad 1.88)
  other vias: 21.59,24.13
N$191  (via drill 1.02 pad 1.88)
  other vias: 19.05,24.13
N$192  (via drill 1.02 pad 1.88)
  other vias: 16.51,24.13
N$193  (via drill 1.02 pad 1.88)
  other vias: 13.97,24.13
N$194  (via drill 1.02 pad 1.88)
  other vias: 11.43,24.13
N$195  (via drill 1.02 pad 1.88)
  other vias: 8.89,24.13
N$196  (via drill 1.02 pad 1.88)
  other vias: 6.35,24.13
N$197  (via drill 1.02 pad 1.88)
  other vias: 3.81,24.13
N$198  (via drill 1.02 pad 1.88)
  other vias: 3.81,26.67
N$199  (via drill 1.02 pad 1.88)
  other vias: 6.35,26.67
N$200  (via drill 1.02 pad 1.88)
  other vias: 8.89,26.67
N$201  (via drill 1.02 pad 1.88)
  other vias: 11.43,26.67
N$202  (via drill 1.02 pad 1.88)
  other vias: 13.97,26.67
N$203  (via drill 1.02 pad 1.88)
  other vias: 16.51,26.67
N$204  (via drill 1.02 pad 1.88)
  other vias: 19.05,26.67
N$205  (via drill 1.02 pad 1.88)
  other vias: 21.59,26.67
N$206  (via drill 1.02 pad 1.88)
  other vias: 24.13,26.67
N$207  (via drill 1.02 pad 1.88)
  other vias: 26.67,26.67
N$208  (via drill 1.02 pad 1.88)
  other vias: 29.21,26.67
N$209  (via drill 1.02 pad 1.88)
  other vias: 31.75,26.67
N$210  (via drill 1.02 pad 1.88)
  other vias: 34.29,26.67
N$211  (via drill 1.02 pad 1.88)
  other vias: 34.29,29.21
N$212  (via drill 1.02 pad 1.88)
  other vias: 31.75,29.21
N$213  (via drill 1.02 pad 1.88)
  other vias: 29.21,29.21
N$214  (via drill 1.02 pad 1.88)
  other vias: 26.67,29.21
N$215  (via drill 1.02 pad 1.88)
  other vias: 24.13,29.21
N$216  (via drill 1.02 pad 1.88)
  other vias: 21.59,29.21
N$217  (via drill 1.02 pad 1.88)
  other vias: 19.05,29.21
N$218  (via drill 1.02 pad 1.88)
  other vias: 16.51,29.21
N$219  (via drill 1.02 pad 1.88)
  other vias: 13.97,29.21
N$220  (via drill 1.02 pad 1.88)
  other vias: 11.43,29.21
N$221  (via drill 1.02 pad 1.88)
  other vias: 8.89,29.21
N$222  (via drill 1.02 pad 1.88)
  other vias: 6.35,29.21
N$223  (via drill 1.02 pad 1.88)
  other vias: 3.81,29.21
N$224  (via drill 1.02 pad 1.88)
  other vias: 3.81,31.75
N$225  (via drill 1.02 pad 1.88)
  other vias: 6.35,31.75
N$226  (via drill 1.02 pad 1.88)
  other vias: 8.89,31.75
N$227  (via drill 1.02 pad 1.88)
  other vias: 11.43,31.75
N$228  (via drill 1.02 pad 1.88)
  other vias: 13.97,31.75
N$229  (via drill 1.02 pad 1.88)
  other vias: 16.51,31.75
N$230  (via drill 1.02 pad 1.88)
  other vias: 19.05,31.75
N$231  (via drill 1.02 pad 1.88)
  other vias: 21.59,31.75
N$232  (via drill 1.02 pad 1.88)
  other vias: 24.13,31.75
N$233  (via drill 1.02 pad 1.88)
  other vias: 26.67,31.75
N$234  (via drill 1.02 pad 1.88)
  other vias: 29.21,31.75
N$235  (via drill 1.02 pad 1.88)
  other vias: 31.75,31.75
N$236  (via drill 1.02 pad 1.88)
  other vias: 34.29,31.75
N$237  (via drill 1.02 pad 1.88)
  other vias: 34.29,34.29
N$238  (via drill 1.02 pad 1.88)
  other vias: 34.29,36.83
N$239  (via drill 1.02 pad 1.88)
  other vias: 34.29,39.37
N$240  (via drill 1.02 pad 1.88)
  other vias: 34.29,41.91
N$241  (via drill 1.02 pad 1.88)
  other vias: 34.29,44.45
N$242  (via drill 1.02 pad 1.88)
  other vias: 34.29,46.99
N$243  (via drill 1.02 pad 1.88)
  other vias: 34.29,49.53
N$244  (via drill 1.02 pad 1.88)
  other vias: 34.29,52.07
N$245  (via drill 1.02 pad 1.88)
  other vias: 31.75,52.07
N$246  (via drill 1.02 pad 1.88)
  other vias: 29.21,52.07
N$247  (via drill 1.02 pad 1.88)
  other vias: 26.67,52.07
N$248  (via drill 1.02 pad 1.88)
  other vias: 24.13,52.07
N$249  (via drill 1.02 pad 1.88)
  other vias: 21.59,52.07
N$250  (via drill 1.02 pad 1.88)
  other vias: 19.05,52.07
N$251  (via drill 1.02 pad 1.88)
  other vias: 16.51,52.07
N$252  (via drill 1.02 pad 1.88)
  other vias: 8.89,49.53
N$253  (via drill 1.02 pad 1.88)
  other vias: 11.43,49.53
N$254  (via drill 1.02 pad 1.88)
  other vias: 13.97,49.53
N$255  (via drill 1.02 pad 1.88)
  other vias: 16.51,49.53
N$256  (via drill 1.02 pad 1.88)
  other vias: 19.05,49.53
N$257  (via drill 1.02 pad 1.88)
  other vias: 21.59,49.53
N$258  (via drill 1.02 pad 1.88)
  other vias: 24.13,49.53
N$259  (via drill 1.02 pad 1.88)
  other vias: 26.67,49.53
N$260  (via drill 1.02 pad 1.88)
  other vias: 29.21,49.53
N$261  (via drill 1.02 pad 1.88)
  other vias: 31.75,49.53
N$262  (via drill 1.02 pad 1.88)
  other vias: 31.75,46.99
N$263  (via drill 1.02 pad 1.88)
  other vias: 29.21,46.99
N$264  (via drill 1.02 pad 1.88)
  other vias: 26.67,46.99
N$265  (via drill 1.02 pad 1.88)
  other vias: 24.13,46.99
N$266  (via drill 1.02 pad 1.88)
  other vias: 21.59,46.99
N$267  (via drill 1.02 pad 1.88)
  other vias: 19.05,46.99
N$268  (via drill 1.02 pad 1.88)
  other vias: 16.51,46.99
N$269  (via drill 1.02 pad 1.88)
  other vias: 13.97,46.99
N$270  (via drill 1.02 pad 1.88)
  other vias: 11.43,46.99
N$271  (via drill 1.02 pad 1.88)
  other vias: 8.89,46.99
N$272  (via drill 1.02 pad 1.88)
  other vias: 6.35,46.99
N$273  (via drill 1.02 pad 1.88)
  other vias: 6.35,44.45
N$274  (via drill 1.02 pad 1.88)
  other vias: 8.89,44.45
N$275  (via drill 1.02 pad 1.88)
  other vias: 11.43,44.45
N$276  (via drill 1.02 pad 1.88)
  other vias: 13.97,44.45
N$277  (via drill 1.02 pad 1.88)
  other vias: 16.51,44.45
N$278  (via drill 1.02 pad 1.88)
  other vias: 19.05,44.45
N$279  (via drill 1.02 pad 1.88)
  other vias: 21.59,44.45
N$280  (via drill 1.02 pad 1.88)
  other vias: 24.13,44.45
N$281  (via drill 1.02 pad 1.88)
  other vias: 26.67,44.45
N$282  (via drill 1.02 pad 1.88)
  other vias: 29.21,44.45
N$283  (via drill 1.02 pad 1.88)
  other vias: 31.75,44.45
N$284  (via drill 1.02 pad 1.88)
  other vias: 31.75,41.91
N$285  (via drill 1.02 pad 1.88)
  other vias: 29.21,41.91
N$286  (via drill 1.02 pad 1.88)
  other vias: 26.67,41.91
N$287  (via drill 1.02 pad 1.88)
  other vias: 24.13,41.91
N$288  (via drill 1.02 pad 1.88)
  other vias: 21.59,41.91
N$289  (via drill 1.02 pad 1.88)
  other vias: 19.05,41.91
N$290  (via drill 1.02 pad 1.88)
  other vias: 16.51,41.91
N$291  (via drill 1.02 pad 1.88)
  other vias: 13.97,41.91
N$292  (via drill 1.02 pad 1.88)
  other vias: 11.43,41.91
N$293  (via drill 1.02 pad 1.88)
  other vias: 8.89,41.91
N$294  (via drill 1.02 pad 1.88)
  other vias: 6.35,41.91
N$295  (via drill 1.02 pad 1.88)
  other vias: 3.81,39.37
N$296  (via drill 1.02 pad 1.88)
  other vias: 6.35,39.37
N$297  (via drill 1.02 pad 1.88)
  other vias: 8.89,39.37
N$298  (via drill 1.02 pad 1.88)
  other vias: 11.43,39.37
N$299  (via drill 1.02 pad 1.88)
  other vias: 13.97,39.37
N$300  (via drill 1.02 pad 1.88)
  other vias: 16.51,39.37
N$301  (via drill 1.02 pad 1.88)
  other vias: 19.05,39.37
N$302  (via drill 1.02 pad 1.88)
  other vias: 21.59,39.37
N$303  (via drill 1.02 pad 1.88)
  other vias: 24.13,39.37
N$304  (via drill 1.02 pad 1.88)
  other vias: 26.67,39.37
N$305  (via drill 1.02 pad 1.88)
  other vias: 29.21,39.37
N$306  (via drill 1.02 pad 1.88)
  other vias: 31.75,39.37
N$307  (via drill 1.02 pad 1.88)
  other vias: 31.75,36.83
N$308  (via drill 1.02 pad 1.88)
  other vias: 29.21,36.83
N$309  (via drill 1.02 pad 1.88)
  other vias: 26.67,36.83
N$310  (via drill 1.02 pad 1.88)
  other vias: 24.13,36.83
N$311  (via drill 1.02 pad 1.88)
  other vias: 21.59,36.83
N$312  (via drill 1.02 pad 1.88)
  other vias: 19.05,36.83
N$313  (via drill 1.02 pad 1.88)
  other vias: 16.51,36.83
N$314  (via drill 1.02 pad 1.88)
  other vias: 13.97,36.83
N$315  (via drill 1.02 pad 1.88)
  other vias: 11.43,36.83
N$316  (via drill 1.02 pad 1.88)
  other vias: 8.89,36.83
N$317  (via drill 1.02 pad 1.88)
  other vias: 6.35,36.83
N$318  (via drill 1.02 pad 1.88)
  other vias: 3.81,36.83
N$319  (via drill 1.02 pad 1.88)
  other vias: 3.81,34.29
N$320  (via drill 1.02 pad 1.88)
  other vias: 6.35,34.29
N$321  (via drill 1.02 pad 1.88)
  other vias: 8.89,34.29
N$322  (via drill 1.02 pad 1.88)
  other vias: 11.43,34.29
N$323  (via drill 1.02 pad 1.88)
  other vias: 13.97,34.29
N$324  (via drill 1.02 pad 1.88)
  other vias: 16.51,34.29
N$325  (via drill 1.02 pad 1.88)
  other vias: 19.05,34.29
N$326  (via drill 1.02 pad 1.88)
  other vias: 21.59,34.29
N$327  (via drill 1.02 pad 1.88)
  other vias: 24.13,34.29
N$328  (via drill 1.02 pad 1.88)
  other vias: 26.67,34.29
N$329  (via drill 1.02 pad 1.88)
  other vias: 29.21,34.29
N$330  (via drill 1.02 pad 1.88)
  other vias: 31.75,34.29
N$331  (via drill 1.02 pad 1.88)
  other vias: 39.37,44.45
N$332  (via drill 1.02 pad 1.88)
  other vias: 41.91,44.45
N$333  (via drill 1.02 pad 1.88)
  other vias: 41.91,41.91
N$334  (via drill 1.02 pad 1.88)
  other vias: 39.37,41.91
N$335  (via drill 1.02 pad 1.88)
  other vias: 39.37,39.37
N$336  (via drill 1.02 pad 1.88)
  other vias: 41.91,39.37
N$337  (via drill 1.02 pad 1.88)
  other vias: 41.91,36.83
N$338  (via drill 1.02 pad 1.88)
  other vias: 39.37,36.83
N$339  (via drill 1.02 pad 1.88)
  other vias: 39.37,34.29
N$340  (via drill 1.02 pad 1.88)
  other vias: 41.91,34.29
N$341  (via drill 1.02 pad 1.88)
  other vias: 41.91,31.75
N$342  (via drill 1.02 pad 1.88)
  other vias: 39.37,31.75
N$343  (via drill 1.02 pad 1.88)
  other vias: 39.37,29.21
N$344  (via drill 1.02 pad 1.88)
  other vias: 41.91,29.21
N$346  (via drill 1.02 pad 1.88)
  other vias: 39.37,3.81
N$347  (via drill 1.02 pad 1.88)
  other vias: 39.37,6.35
N$348  (via drill 1.02 pad 1.88)
  other vias: 39.37,8.89
N$349  (via drill 1.02 pad 1.88)
  other vias: 39.37,11.43
N$350  (via drill 1.02 pad 1.88)
  other vias: 39.37,13.97
N$351  (via drill 1.02 pad 1.88)
  other vias: 39.37,16.51
N$352  (via drill 1.02 pad 1.88)
  other vias: 39.37,19.05
N$353  (via drill 1.02 pad 1.88)
  other vias: 39.37,21.59
N$354  (via drill 1.02 pad 1.88)
  other vias: 39.37,24.13
N$355  (via drill 1.02 pad 1.88)
  other vias: 39.37,26.67
N$356  (via drill 1.02 pad 1.88)
  other vias: 41.91,19.05
N$357  (via drill 1.02 pad 1.88)
  other vias: 41.91,16.51
N$358  (via drill 1.02 pad 1.88)
  other vias: 41.91,13.97
N$359  (via drill 1.02 pad 1.88)
  other vias: 41.91,11.43
N$360  (via drill 1.02 pad 1.88)
  other vias: 41.91,8.89
N$361  (via drill 1.02 pad 1.88)
  other vias: 41.91,6.35
N$362  (via drill 1.02 pad 1.88)
  other vias: 41.91,3.81
RIN
  Top 0.254: J1.TIP 79.74,44.7 78.34,46.1 JP2.1
ROUT
  Top 0.813: J2.TIP 72.66,31.64 71.63,30.61 71.63,28.56 70.38,27.3 58.33,27.3 55.88,29.76 C4.2 55.88,29.72 R3.P$2
V_BATT  (via drill 0.38)
  Top 0.254: C9.2 R9.2 65.57,23.91 v64.77,23.11 64.52,22.86 U3.8 | U3.5 65.52,18.22 65.72,18.02 66.29,18.02 v67.94,18.02
  Top 0.61: L1.P$1 62,13.87 U2.3
  Top 0.813: 67.06,18.02 67.06,14.84 66.08,13.87 L1.P$1 | C11.2 v67.94,18.02 67.06,18.02 | 67.06,18.02 66.29,18.02
  Bottom 0.254: POT1.SW1 67.94,21.3 | 67.94,21.3 v67.94,18.02 | 67.94,21.3 66.59,21.3 v64.77,23.11
V_USB  (via drill 0.38)
  Top 0.254: U4.4 55.43,21.91 55.24,22.1 | 55.24,22.1 C13.1 | R16.2 v54.23,11.94 | v54.48,21.84 54.74,22.1 55.24,22.1 | J3.VBUS 45.47,49.91
  Top 0.61: 45.47,49.91 v45.47,40.89
  Bottom 0.61: v45.47,40.89 45.47,30.86 v54.48,21.84 54.48,12.19 v54.23,11.94

### Text on the board
Bottom: v01
tPlace: 5V | 100k | 100k | Left | D+ | D- | 1uF | 1uF | Right | 20k | 20k | IN | 100uF | 100uF | 1.0k | 1.0k | OUT | BTL / OUT | Pocket Amp | PWR/VOL | 470 | 18.2k | 10k | 470 | GND
Measures: Units are in inches
tDocu: Alex Wende